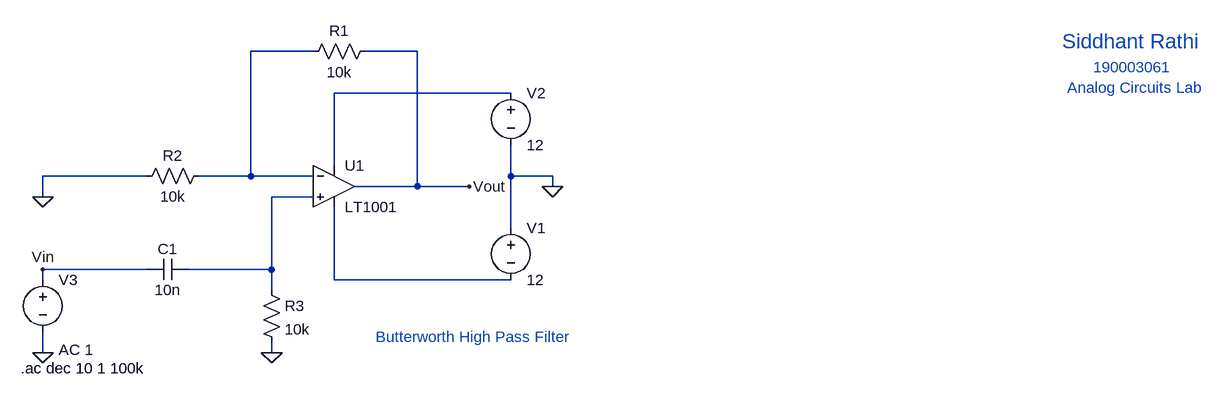
[diagram p0: schematic Butterworth HPF.asc]
Butterworth HPF.asc, the LTspice schematic file:
Version 4
SHEET 1 1556 680
WIRE 160 -48 64 -48
WIRE 320 -48 240 -48
WIRE 464 16 192 16
WIRE 192 128 192 16
WIRE -96 144 -256 144
WIRE 64 144 64 -48
WIRE 64 144 -16 144
WIRE 160 144 64 144
WIRE 464 144 464 96
WIRE 528 144 464 144
WIRE 320 160 320 -48
WIRE 320 160 224 160
WIRE 400 160 320 160
WIRE 528 160 528 144
WIRE -256 176 -256 144
WIRE 160 176 96 176
WIRE 464 224 464 144
WIRE -96 288 -256 288
WIRE 96 288 96 176
WIRE 96 288 -32 288
WIRE -256 304 -256 288
WIRE 192 304 192 192
WIRE 464 304 192 304
WIRE 96 320 96 288
WIRE -256 416 -256 384
WIRE 96 416 96 400
FLAG -256 176 0
FLAG -256 416 0
FLAG 96 416 0
FLAG 528 160 0
FLAG -256 288 Vin
FLAG 400 160 Vout
SYMBOL OpAmps\\LT1001 192 96 R0
SYMATTR InstName U1
SYMBOL res 256 -64 R90
WINDOW 0 0 56 VBottom 2
WINDOW 3 32 56 VTop 2
SYMATTR InstName R1
SYMATTR Value 10k
SYMBOL res 0 128 R90
WINDOW 0 0 56 VBottom 2
WINDOW 3 32 56 VTop 2
SYMATTR InstName R2
SYMATTR Value 10k
SYMBOL voltage 464 208 R0
WINDOW 123 0 0 Left 0
WINDOW 39 0 0 Left 0
SYMATTR InstName V1
SYMATTR Value 12
SYMBOL voltage 464 0 R0
WINDOW 123 0 0 Left 0
WINDOW 39 0 0 Left 0
SYMATTR InstName V2
SYMATTR Value 12
SYMBOL voltage -256 288 R0
WINDOW 123 24 124 Left 2
WINDOW 39 0 0 Left 0
SYMATTR InstName V3
SYMATTR Value ""
SYMATTR Value2 AC 1
SYMBOL cap -32 272 R90
WINDOW 0 0 32 VBottom 2
WINDOW 3 32 32 VTop 2
SYMATTR InstName C1
SYMATTR Value 10n
SYMBOL res 80 304 R0
SYMATTR InstName R3
SYMATTR Value 10k
TEXT 256 392 Left 2 ;Butterworth High Pass Filter
TEXT -290 440 Left 2 !.ac dec 10 1 100k
TEXT 1312 -64 Left 3 ;Siddhant Rathi
TEXT 1360 -24 Left 2 ;190003061
TEXT 1320 8 Left 2 ;Analog Circuits Lab

The netlist it stands for:
* Butterworth HPF.asc
XU1 N003 N001 N002 N004 Vout LT1001  ; pins In+ In- V+ V- OUT
R1 Vout N001 10k
R2 N001 0 10k
V1 0 N004 12
V2 N002 0 12
V3 Vin 0 AC 1
C1 N003 Vin 10n
R3 N003 0 10k
* Butterworth High Pass Filter
.ac dec 10 1 100k
* Siddhant Rathi
* 190003061
* Analog Circuits Lab
.lib LTC.lib
.backanno
.end